# EAGLE design NES_Controller_Board (EAGLE 9.6.2)
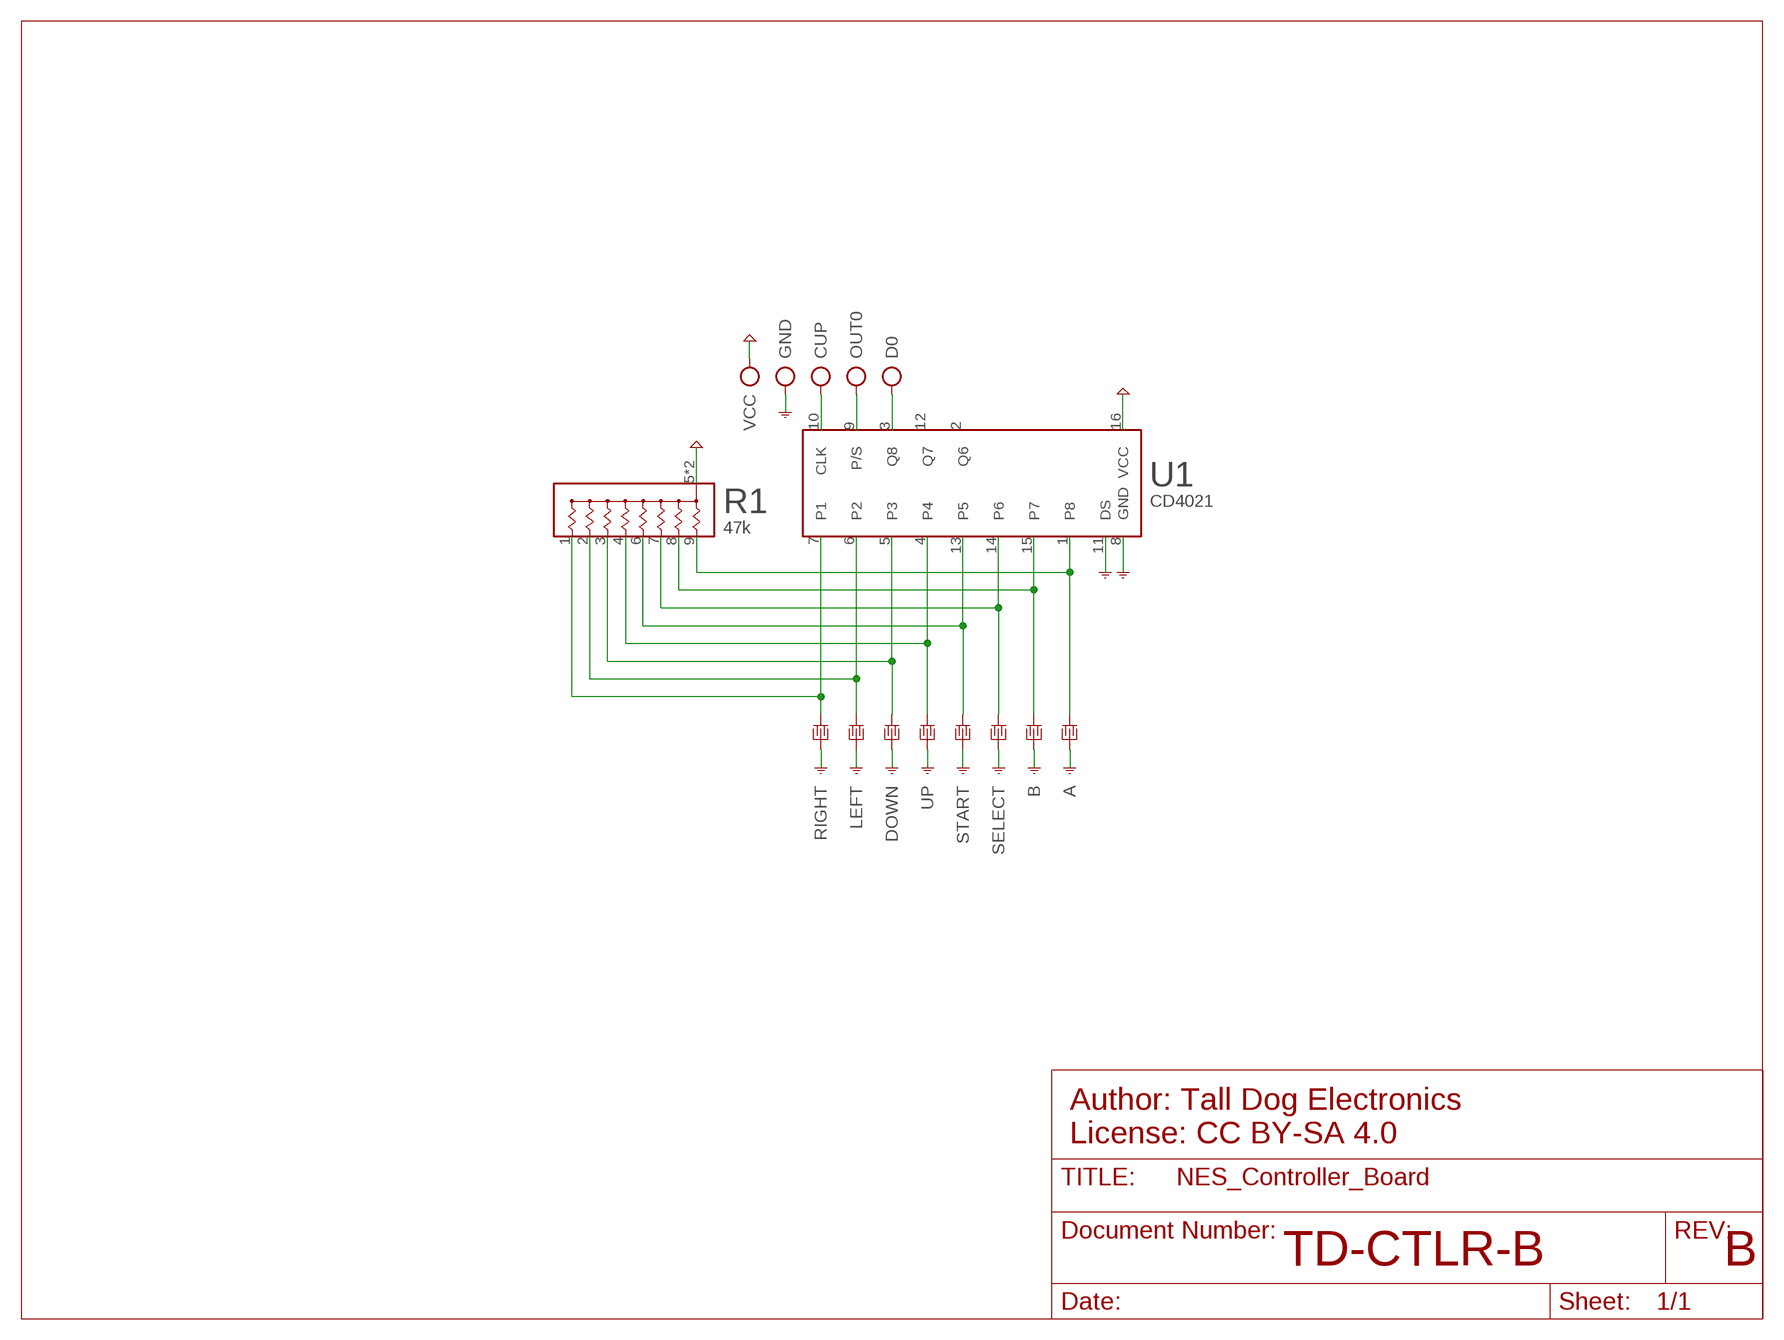
[diagram p0: schematic, sheet 1]

## Parts
A  BUTTON-PAD-AB  [CTRL-AB]
B  BUTTON-PAD-AB  [CTRL-AB]
CUP  2/RD  HOLE  [PTH-STRAIN]
D0  4/YL  HOLE  [PTH-STRAIN]
DOWN  BUTTON-PAD-DPAD  [CTRL-DPAD]
GND  1/BN  HOLE  [PTH-STRAIN]
LEFT  BUTTON-PAD-DPAD  [CTRL-DPAD]
OUT0  3/OR  HOLE  [PTH-STRAIN]
R1  47k  RA8  [EXBA10P]
RIGHT  BUTTON-PAD-DPAD  [CTRL-DPAD]
SELECT  BUTTON-PAD-STSEL  [CTRL-STSEL]
START  BUTTON-PAD-STSEL  [CTRL-STSEL]
U1  CD4021  [SOIC-16]
UP  BUTTON-PAD-DPAD  [CTRL-DPAD]
VCC  5/WH  HOLE  [PTH-STRAIN]

## Nets
CUP: CUP.A CUP.P U1.10(CLK)
D0: D0.A D0.P U1.3(Q8)
GND: A.A B.A DOWN.A GND.A GND.P LEFT.A RIGHT.A SELECT.A START.A U1.8(GND) U1.11(DS) UP.A
N$1: LEFT.B R1.2 U1.6(P2)
N$2: R1.4 U1.4 UP.B
N$11: DOWN.B R1.3 U1.5(P3)
N$12: R1.1 RIGHT.B U1.7(P1)
N$13: R1.6 START.B U1.13(P5)
N$14: R1.7 SELECT.B U1.14(P6)
N$15: B.B R1.8 U1.15(P7)
N$16: A.B R1.9 U1.1(P8)
OUT0: OUT0.A OUT0.P U1.9(P/S)
VCC: R1.5(COM) R1.10(COM) U1.16(VCC) VCC.A VCC.P
Unconnected: U1.2(Q6) U1.12(Q7)

## Notes on the sheet
- Author: Tall Dog Electronics
  License: CC BY-SA 4.0
- TD-CTLR-B | B

## Library data of the parts
A B DOWN LEFT RIGHT SELECT START UP = TinyNES_Library:BUTTON-PAD
CUP D0 GND OUT0 VCC = TinyNES_Library:HOLE
R1 = TinyNES_Library:RA8
U1 = TinyNES_Library:CD4021

## Board
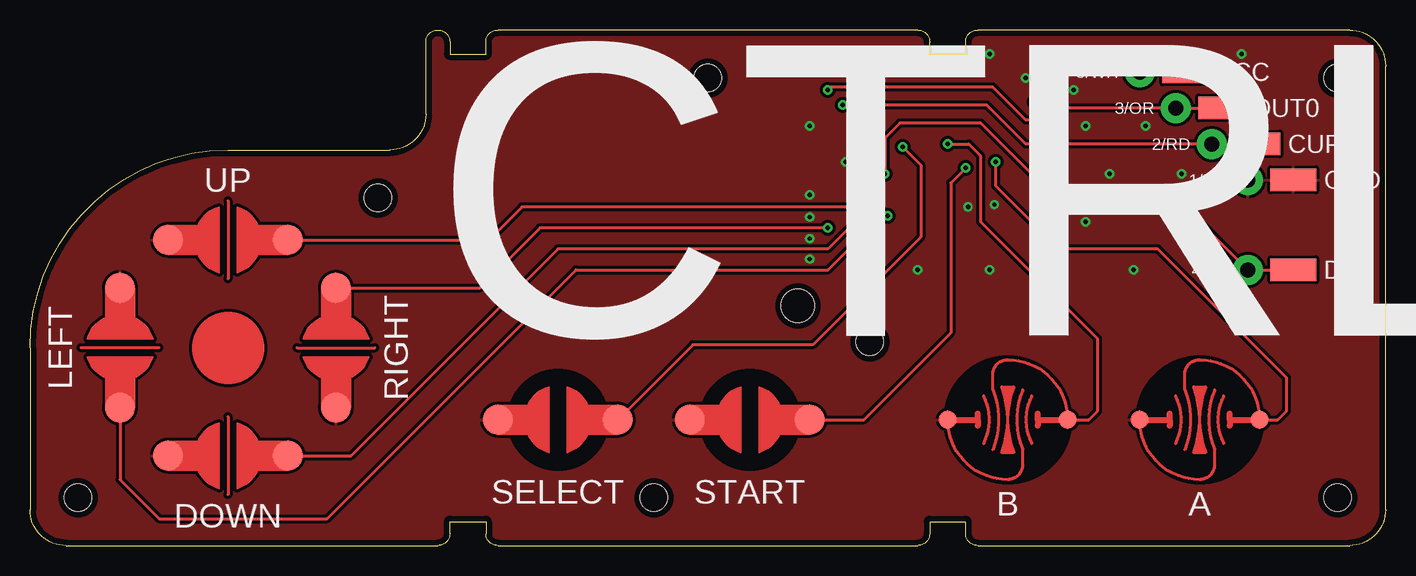
[diagram p1: board, top side]
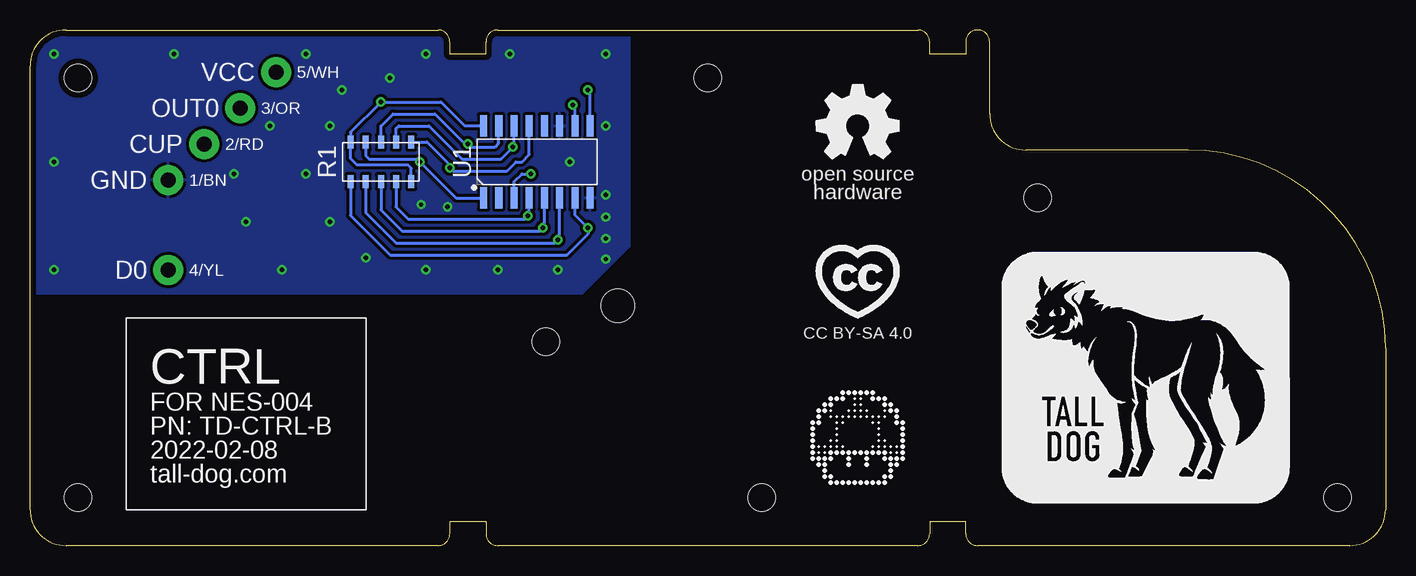
[diagram p2: board, bottom side, seen from below]

Size 113 x 43 mm. Coordinates in mm from the lower left corner, seen from the top.
Outline: 3,0 34,0 arc90 35,1 35,2 38,2 38,1 arc90 39,0 74,0 arc90 75,1 75,2 78,2 78,1 arc90 79,0 110,0 arc90 113,3 113,40 arc90 110,43 79,43 arc90 78,42 78,41 75,41 75,42 arc90 74,43 39,43 arc90 38,42 38,41 35,41 35,42 arc90 34,43 arc90 33,42 33,36 arc-90 30,33 16.5,33 arc90 0,16.5 0,3 arc90 3,0
Copper layers (1*16): Top 0.035mm / dielectric 1.5mm / Bottom 0.035mm
Design rules "default *": minimum track width 6mil, minimum drill 0.35mm, track to track 6mil, track to pad 6mil, pad to pad 6mil, via to via 6mil, smd to smd 6mil, copper to edge 0.5mm, drill to drill 6mil, minimum pad ring 10mil, minimum via ring 8mil, stop-mask expansion 0mil, vias tented up to drill 0.35mm, thermal gap 0.25mm
Holes 2.25 mm at 4,4 109,4 109,39 52,4 29,29 56.5,39 70,17
Holes 2.75 mm at 64,20

### Footprints (pad centres in the part's own frame; a part is rotated, then mirrored left to right if it is on the bottom)
CTRL-AB = smd 1.5 x 1.5: A -5,0; B 5,0
PTH-STRAIN = drill 1.25 pad 2.5: A 0,0 | smd 3.81 x 1.905 bottom: P -3.81,0
CTRL-DPAD = smd 2.5 x 2.5: A -5,0; B 5,0
EXBA10P = smd 0.5 x 1.1: 1 -2.54,-1.65; 2 -1.27,-1.65; 3 0,-1.65; 4 1.27,-1.65; 5 2.54,-1.65; 6 2.54,1.65; 7 1.27,1.65; 8 0,1.65; 9 -1.27,1.65; 10 -2.54,1.65
CTRL-STSEL = smd 2.5 x 2.5: A -5,0; B 5,0
SOIC-16 = smd 0.6 x 1.8: 1 -4.445,-3; 2 -3.175,-3; 3 -1.905,-3; 4 -0.635,-3; 5 0.635,-3; 6 1.905,-3; 7 3.175,-3; 8 4.445,-3; 9 4.445,3; 10 3.175,3; 11 1.905,3; 12 0.635,3; 13 -0.635,3; 14 -1.905,3; 15 -3.175,3; 16 -4.445,3

### Placement (x,y rotation side)
A  97.5,10.5 0 top
B  81.5,10.5 0 top
CUP  98.5,33.5 0 bottom
D0  101.5,23 0 bottom
DOWN  16.5,7.5 0 top
GND  101.5,30.5 0 bottom
LEFT  7.5,16.5 270 top
OUT0  95.5,36.5 0 bottom
R1  83.75,32 0 bottom
RIGHT  25.5,16.5 90 top
SELECT  44,10.5 0 top
START  60,10.5 0 top
U1  70.75,32 0 bottom
U$1  [_LOGO-TALL-DOG]  20,14 0 bottom
U$2  [_PIXEL-ART-1UP]  44,9 0 bottom
U$3  [_LOGO-OSH]  44,35 0 bottom
U$4  [_LOGO-CC-BY-SA]  44,22 0 bottom
UP  16.5,25.5 0 top
VCC  92.5,39.5 0 bottom

### Tracks (layer width: path | path; a pad name or v marks a point on that pad's centre or on a via)
CUP  (via drill 0.35)
  Top 0.25: v67.75,36.75 79.75,36.75 83,33.5 CUP.A CUP.P
  Bottom 0.25: v67.75,36.75 67.58,36.58 U1.10
D0  (via drill 0.35)
  Top 0.25: v71.25,31 71.25,34 72.5,35.25 79.25,35.25 85.25,29.25 95.25,29.25 D0.A D0.P
  Bottom 0.25: U1.3 72.66,30.34 72,31 v71.25,31
GND  (via drill 0.35)
  other vias: 80.4,28.45 78.2,28.25 80,23 74,23 85,24 88,27 90,31 88,35 87,38 83,39 68,32 69,23 65,27.4 65,25.6 65,23.9 80,41 73,41 95,27 93,35 90,41 92,23 65,41 65,29.25 111,41 111,23 111,32 101,41 65,35 96,31
  pour Top (isolate 0.25): 0,43 113,43 113,0 0,0
  pour Bottom (isolate 0.25): 63,43 113,43 113,21 67,21 63,25
N$1  (via drill 0.35)
  Top 0.25: LEFT.B 7.5,5.5 10.75,2.25 24.75,2.25 45.5,23 66.5,23 v69,25.5
  Bottom 0.25: R1.2 85.02,27.77 82.5,25.25 69.25,25.25 v69,25.5 68.84,25.66 U1.6
N$2  (via drill 0.35)
  Top 0.25: UP.B 38.25,25.5 41,28.25 70.75,28.25 v71.5,27.5
  Bottom 0.25: R1.4 82.48,28.23 81.5,27.25 71.75,27.25 v71.5,27.5 71.39,27.61 U1.4
N$11  (via drill 0.35)
  Top 0.25: DOWN.B 26.75,7.5 44,24.75 66.5,24.75 68.75,27 69.75,27 v70.25,26.5
  Bottom 0.25: R1.3 83.75,28 82,26.25 70.5,26.25 v70.25,26.5 70.11,26.64 U1.5
N$12  (via drill 0.35)
  Top 0.25: RIGHT.B 37.5,21.5 42.5,26.5 v66.5,26.5
  Bottom 0.25: R1.1 86.29,27.54 83,24.25 68.25,24.25 66.5,26 v66.5,26.5 67.58,27.57 U1.7
N$13  (via drill 0.35)
  Top 0.25: START.B 69.5,10.5 76.75,17.75 76.75,30.25 v78,31.5
  Bottom 0.25: R1.6 79.9,33.65 78,31.75 v78,31.5 77.75,31.25 73.25,31.25 72.5,32 72,32 71.39,32.62 U1.13
N$14  (via drill 0.35)
  Top 0.25: SELECT.B 55.25,16.75 65.25,16.75 74.25,25.75 74.25,31.75 v72.75,33.25
  Bottom 0.25: R1.7 82.48,34.77 82.25,35 79.75,35 77,32.25 73.75,32.25 v72.75,33.25 72.66,33.34 U1.14
N$15  (via drill 0.35)
  Top 0.25: B.B 88.25,10.5 89,11.25 89,17.25 79.25,27 79.25,32.5 78.25,33.5 v76.5,33.5
  Bottom 0.25: R1.8 83.75,35 82.75,36 79.25,36 76.75,33.5 v76.5,33.5 76.5,33.25 74.25,33.25 73.92,33.58 U1.15
N$16  (via drill 0.35)
  Top 0.25: A.B 104,10.5 104.75,11.25 104.75,14 94,24.75 85.75,24.75 80.5,30 v80.5,32
  Bottom 0.25: R1.9 85.02,32.52 84.75,32.25 80.75,32.25 v80.5,32 77.5,29 U1.1
OUT0  (via drill 0.35)
  Top 0.25: v66.5,38 66.75,38.25 80.25,38.25 83,35.5 84.5,35.5 85.5,36.5 OUT0.A OUT0.P
  Bottom 0.25: U1.9 66.31,37.8 v66.5,38
VCC  (via drill 0.35)
  Top 0.25: v83.75,37 86.25,39.5 VCC.A VCC.P
  Bottom 0.25: U1.16 76.75,35 78.75,37 v83.75,37 86.29,34.46 R1.10 86.29,32.29 85.75,31.75 81.5,31.75 81.21,31.46 R1.5
(copper drawn outside any net)
  shapes: Top circle x1

### Text on the board
tPlace: CTRL
bPlace: CTRL | FOR NES-004 | PN: TD-CTRL-B | 2022-02-08 | tall-dog.com